# EAGLE design LEDMatrix (EAGLE 6.2)
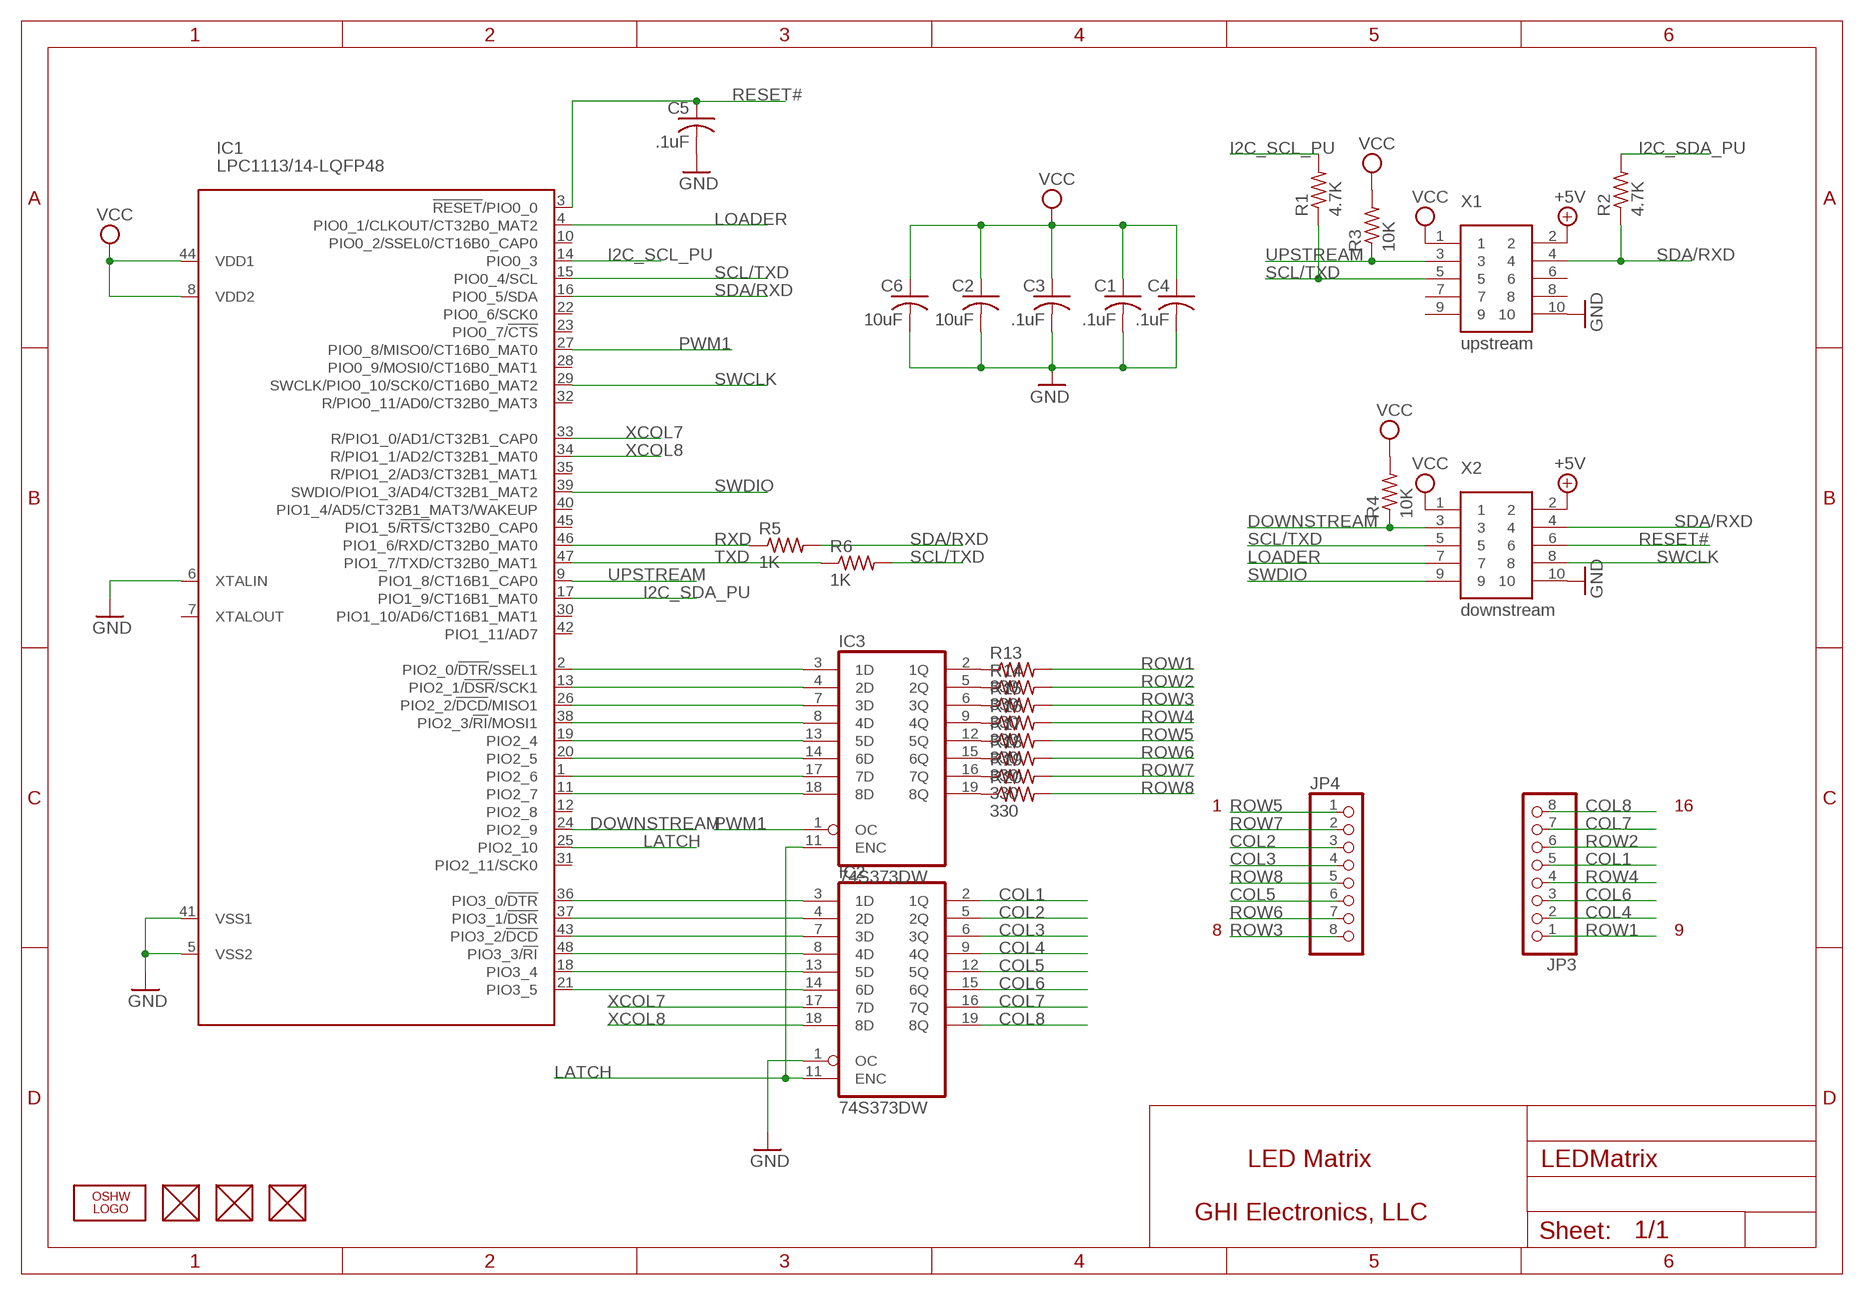
[diagram p0: schematic, sheet 1]

## Parts
C1  .1uF  C-USC0603K  [C0603K]
C2  10uF  C-USC0805K  [C0805K]
C3  .1uF  C-USC0603K  [C0603K]
C4  .1uF  C-USC0603K  [C0603K]
C5  .1uF  C-USC0603K  [C0603K]
C6  10uF  C-USC0805K  [C0805K]
FUD1  FIDUCIAL  [FIDUCIAL_40MIL]
FUD2  FIDUCIAL  [FIDUCIAL_40MIL]
FUD3  FIDUCIAL  [FIDUCIAL_40MIL]
IC1  LPC1113/14-LQFP48  [LQFP48]
IC2  74S373DW  [SO20W]
IC3  74S373DW  [SO20W]
JP3  PINHD-1X8  [1X08]
JP4  PINHD-1X8  [1X08]
LOGO  LOGO-OSHW-FILLX0200-NT  [OSHW_FILLX200_NOTEXT]
R1  4.7K  R-US_R0603  [R0603]
R2  4.7K  R-US_R0603  [R0603]
R3  10K  R-US_R0603  [R0603]
R4  10K  R-US_R0603  [R0603]
R5  1K  R-US_R0603  [R0603]
R6  1K  R-US_R0603  [R0603]
R13  330  R-US_R0603  [R0603]
R14  330  R-US_R0603  [R0603]
R15  330  R-US_R0603  [R0603]
R16  330  R-US_R0603  [R0603]
R17  330  R-US_R0603  [R0603]
R18  330  R-US_R0603  [R0603]
R19  330  R-US_R0603  [R0603]
R20  330  R-US_R0603  [R0603]
X1  upstream  2X5_1.27MM  [2X5_1.27MM]
X2  downstream  2X5_1.27MM  [2X5_1.27MM]

## Nets
+5V [power]: X1.2 X2.2
COL1: IC2.2(1Q) JP3.5
COL2: IC2.5(2Q) JP4.3
COL3: IC2.6(3Q) JP4.4
COL4: IC2.9(4Q) JP3.2
COL5: IC2.12(5Q) JP4.6
COL6: IC2.15(6Q) JP3.3
COL7: IC2.16(7Q) JP3.7
COL8: IC2.19(8Q) JP3.8
DOWNSTREAM: IC1.24(PIO2_9) R4.1 X2.3
GND [power]: C1.2 C2.2 C3.2 C4.2 C5.2 C6.2 IC1.5(VSS2) IC1.6(XTALIN) IC1.41(VSS1) IC2.1(OC) X1.10 X2.10
I2C_SCL_PU: IC1.14(PIO0_3) R1.2
I2C_SDA_PU: IC1.17(PIO1_9/CT16B1_MAT0) R2.2
LATCH: IC1.25(PIO2_10) IC2.11(ENC) IC3.11(ENC)
LOADER: IC1.4(PIO0_1/CLKOUT/CT32B0_MAT2) X2.7
N$11: IC1.36(PIO3_0/!DTR!) IC2.3(1D)
N$12: IC1.37(PIO3_1/!DSR!) IC2.4(2D)
N$13: IC1.43(PIO3_2/!DCD!) IC2.7(3D)
N$14: IC1.48(PIO3_3/!RI!) IC2.8(4D)
N$15: IC1.18(PIO3_4) IC2.13(5D)
N$16: IC1.21(PIO3_5) IC2.14(6D)
N$17: IC3.2(1Q) R13.1
N$18: IC1.2(PIO2_0/!DTR!/SSEL1) IC3.3(1D)
N$19: IC1.13(PIO2_1/!DSR!/SCK1) IC3.4(2D)
N$20: IC1.26(PIO2_2/!DCD!/MISO1) IC3.7(3D)
N$21: IC1.38(PIO2_3/!RI!/MOSI1) IC3.8(4D)
N$22: IC3.5(2Q) R14.1
N$23: IC1.19(PIO2_4) IC3.13(5D)
N$24: IC1.20(PIO2_5) IC3.14(6D)
N$25: IC1.1(PIO2_6) IC3.17(7D)
N$26: IC1.11(PIO2_7) IC3.18(8D)
N$27: IC3.6(3Q) R15.1
N$28: IC3.9(4Q) R16.1
N$29: IC3.12(5Q) R17.1
N$30: IC3.15(6Q) R18.1
N$31: IC3.16(7Q) R19.1
N$32: IC3.19(8Q) R20.1
PWM1: IC1.27(PIO0_8/MISO0/CT16B0_MAT0) IC3.1(OC)
RESET#: C5.1 IC1.3(!RESET!/PIO0_0) X2.6
ROW1: JP3.1 R13.2
ROW2: JP3.6 R14.2
ROW3: JP4.8 R15.2
ROW4: JP3.4 R16.2
ROW5: JP4.1 R17.2
ROW6: JP4.7 R18.2
ROW7: JP4.2 R19.2
ROW8: JP4.5 R20.2
RXD: IC1.46(PIO1_6/RXD/CT32B0_MAT0) R5.1
SCL/TXD: IC1.15(PIO0_4/SCL) R1.1 R6.2 X1.5 X2.5
SDA/RXD: IC1.16(PIO0_5/SDA) R2.1 R5.2 X1.4 X2.4
SWCLK: IC1.29(SWCLK/PIO0_10/SCK0/CT16B0_MAT2) X2.8
SWDIO: IC1.39(SWDIO/PIO1_3/AD4/CT32B1_MAT2) X2.9
TXD: IC1.47(PIO1_7/TXD/CT32B0_MAT1) R6.1
UPSTREAM: IC1.9(PIO1_8/CT16B1_CAP0) R3.1 X1.3
VCC [power]: C1.1 C2.1 C3.1 C4.1 C6.1 IC1.8(VDD2) IC1.44(VDD1) R3.2 R4.2 X1.1 X2.1
XCOL7: IC1.33(R/PIO1_0/AD1/CT32B1_CAP0) IC2.17(7D)
XCOL8: IC1.34(R/PIO1_1/AD2/CT32B1_MAT0) IC2.18(8D)
Unconnected: FUD1.P$1 FUD2.P$1 FUD3.P$1 IC1.7(XTALOUT) IC1.10(PIO0_2/SSEL0/CT16B0_CAP0) IC1.12(PIO2_8) IC1.22(PIO0_6/SCK0) IC1.23(PIO0_7/!CTS!) IC1.28(PIO0_9/MOSI0/CT16B0_MAT1) IC1.30(PIO1_10/AD6/CT16B1_MAT1) IC1.31(PIO2_11/SCK0) IC1.32(R/PIO0_11/AD0/CT32B0_MAT3) IC1.35(R/PIO1_2/AD3/CT32B1_MAT1) IC1.40(PIO1_4/AD5/CT32B1_MAT3/WAKEUP) IC1.42(PIO1_11/AD7) IC1.45(PIO1_5/!RTS!/CT32B0_CAP0) X1.6 X1.7 X1.8 X1.9

## Notes on the sheet
- 1 | 16
- 8 | 9
- LED Matrix
- GHI Electronics, LLC

## Power pins joined to a net without a drawn wire
GND: IC2.10(GND) IC3.10(GND)
VCC: IC2.20(VCC) IC3.20(VCC)

## Library data of the parts
C1-C6 = rcl:C-US: CAPACITOR, American symbol
FUD1-FUD3 = GHI:FIDUCIAL
IC1 = lpc1100v1.1:LPC1113/14-LQFP48: NXP Semiconductors LPC11xx microcontrollers <http://ics.nxp.com/products/lpc1000/lpc11xx/> ARM 32-bit Cortex-M0 Microcontroller with MPU CPU clock up to 50MHz Up to 32KByte on-chip Flash ROM with In-System Programming (ISP) and In-Application Programming (IAP) via On-Chip Bootloader Up to 8KByte SRAM Nested Vectored Interrupt Controller Up to 2 SPI controllers UART with full Modem Interface and RS485 Support Fast Mode I2C-Bus 4 Timers with 4 capture channels and 13 output channels Watchdog (WDT) Sytem tick timer 10-bit ADC with 8 channels Power Management Unit (PMU) Brownout detection 12MHz internal RC oscillator Serial Wire Debug/Trace port
IC2 IC3 = 74xx-us:74*373: Octal D type transparent LATCH, edge triggered
JP3 JP4 = pinhead:PINHD-1X8: PIN HEADER
LOGO = Logo:LOGO-OSHW-FILL
R1-R6 R13-R20 = rcl:R-US_: RESISTOR, American symbol
X1 X2 = GHI:2X5_1.27MM

## Board
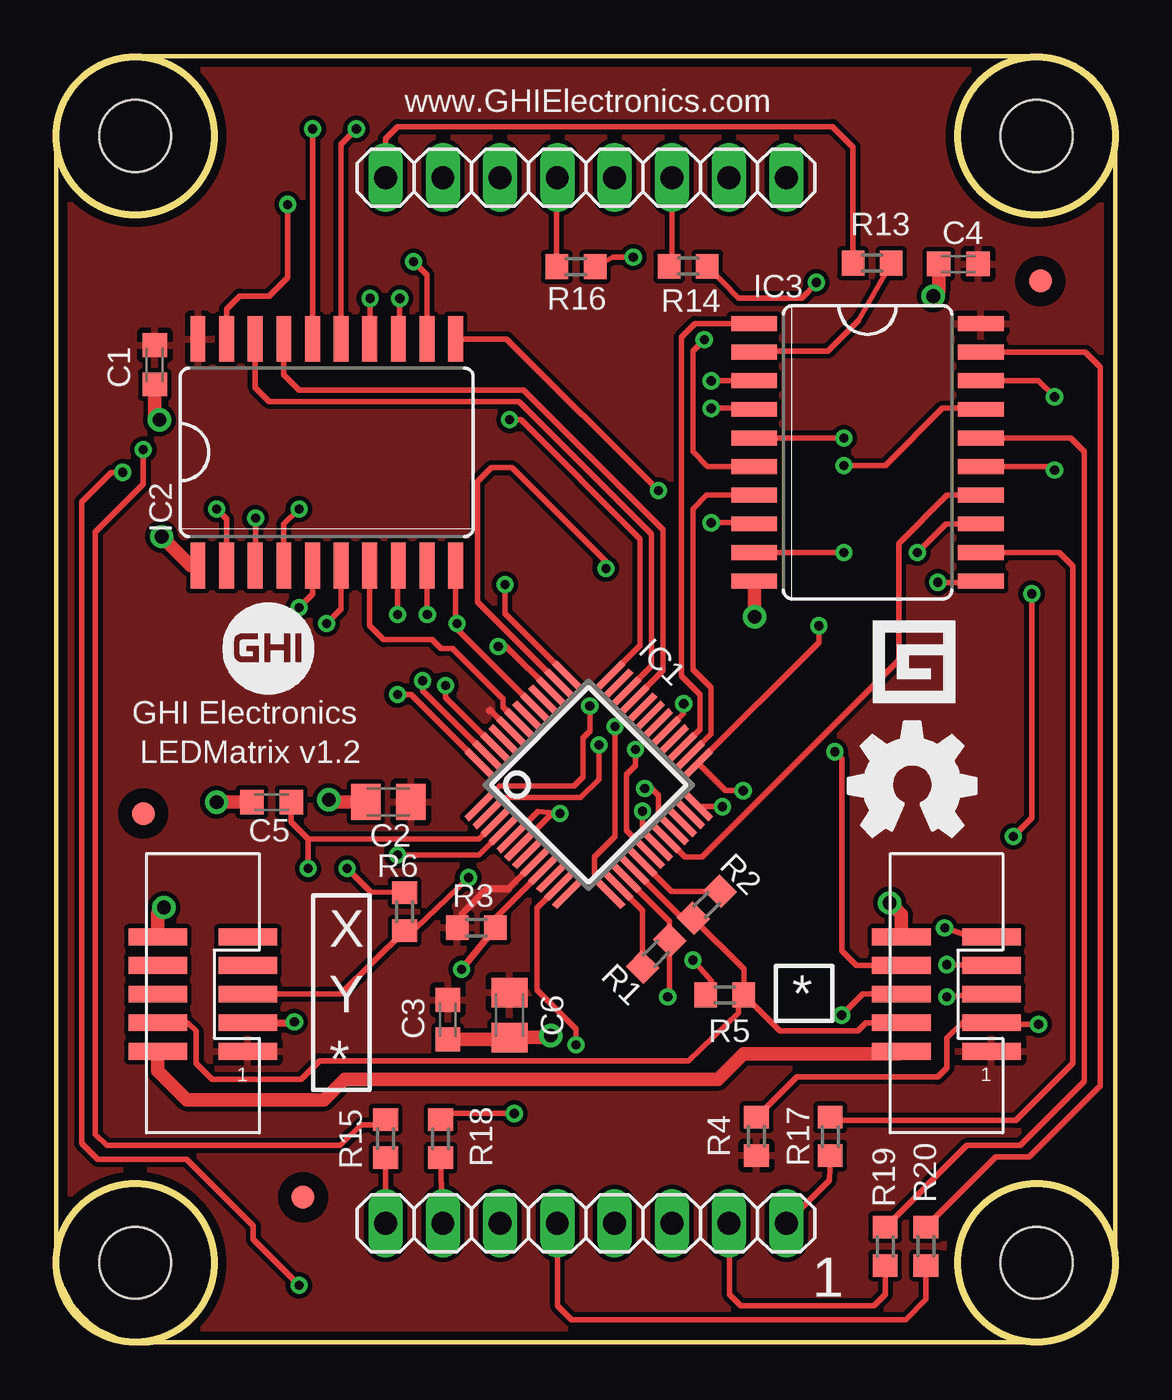
[diagram p1: board, top side]
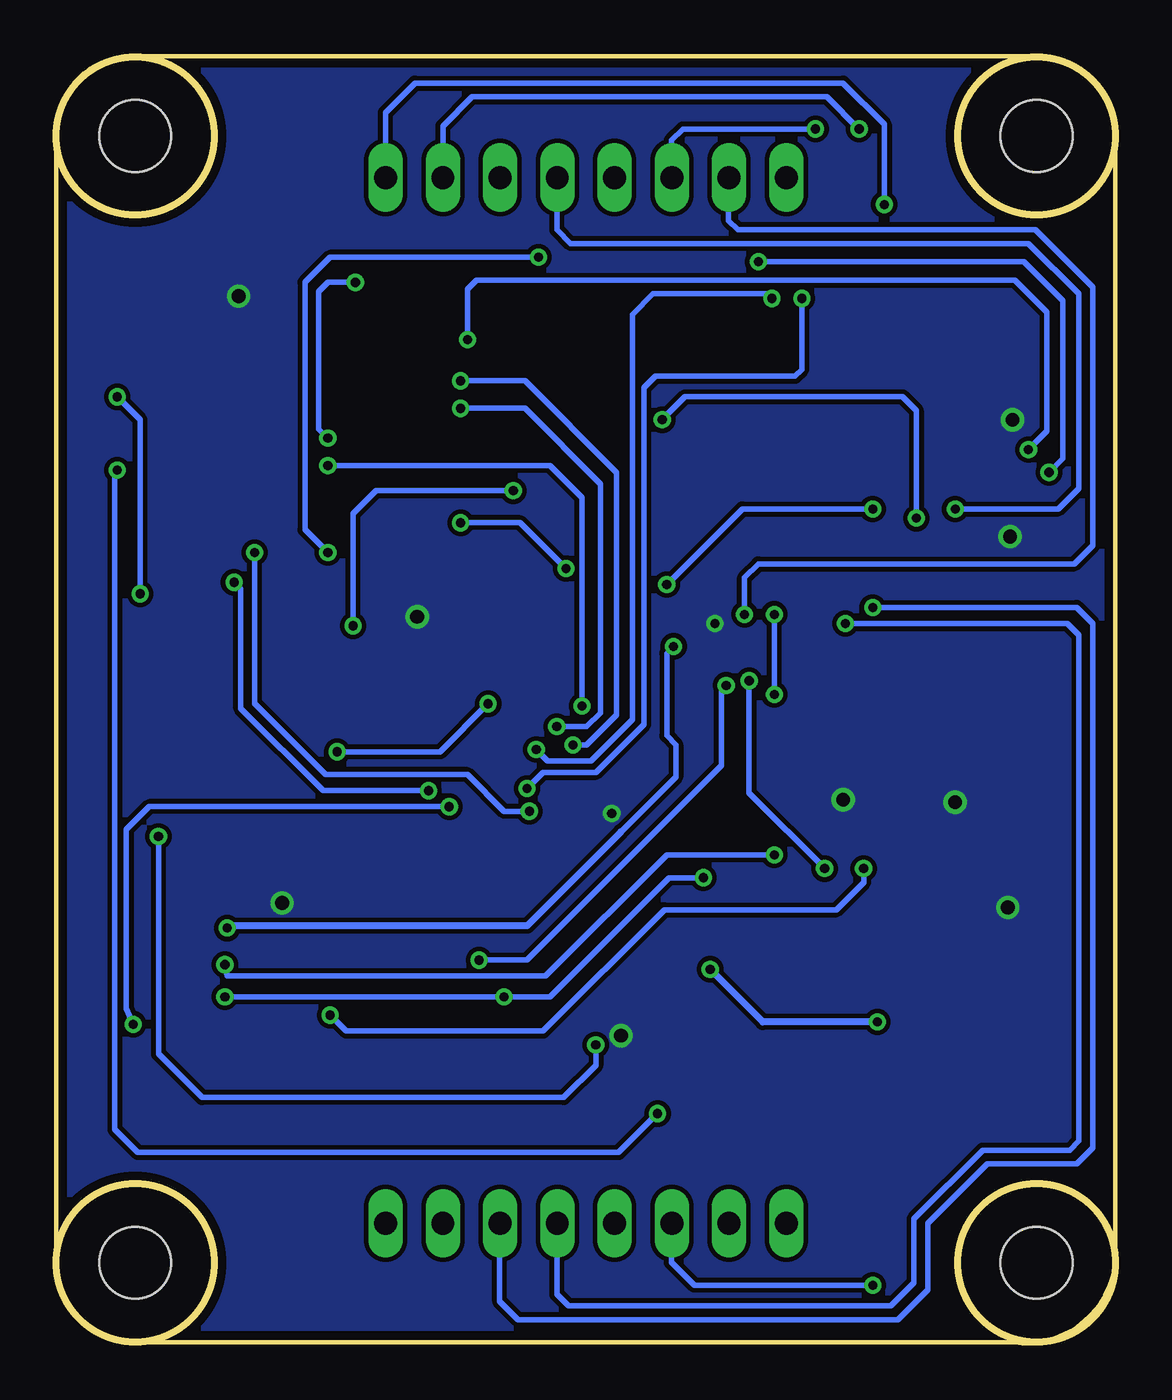
[diagram p2: board, bottom side, seen from below]

Size 47 x 57.1 mm. Coordinates in mm from the lower left corner, seen from the top.
Outline: 0,53.6 0,3.53 arc90 4.5,0.03 43.25,0.03 arc90 47,3.53 47,53.6 arc90 43.75,57.1 3.5,57.1 arc90 0,53.6
Outline: circle at 3.5,3.57 radius 3.5
Outline: circle at 3.5,53.57 radius 3.5
Outline: circle at 43.5,53.57 radius 3.5
Outline: circle at 43.5,3.57 radius 3.5
Copper layers (1+16): Top 0.035mm / dielectric 1.5mm / Bottom 0.035mm
Design rules: minimum track width 8mil, minimum drill 12mil, track to track 8mil, track to pad 8mil, pad to pad 7.5mil, via to via 8mil, smd to smd 7.5mil, copper to edge 15mil, drill to drill 8mil, minimum pad ring 10mil, minimum via ring 7mil, stop-mask expansion 4mil, vias tented up to drill 50mil, thermal gap 10mil
Holes 3.2 mm at 3.5,3.57 3.5,53.57 43.5,53.57 43.5,3.57

### Footprints (pad centres in the part's own frame; a part is rotated, then mirrored left to right if it is on the bottom)
C0603K = smd 1.05 x 1.08: 1 -0.875,0; 2 0.875,0
C0805K = smd 1.3 x 1.6: 1 -1,0; 2 1,0
FIDUCIAL_40MIL = smd 1.016 x 1.016: P$1 0,0
LQFP48 = smd 0.3 x 1.6: 1 -2.75,-4.1; 2 -2.25,-4.1; 3 -1.75,-4.1; 4 -1.25,-4.1; 5 -0.75,-4.1; 6 -0.25,-4.1; 7 0.25,-4.1; 8 0.75,-4.1; 9 1.25,-4.1; 10 1.75,-4.1; 11 2.25,-4.1; 12 2.75,-4.1; 25 2.75,4.1; 26 2.25,4.1; 27 1.75,4.1; 28 1.25,4.1; 29 0.75,4.1; 30 0.25,4.1; 31 -0.25,4.1; 32 -0.75,4.1; 33 -1.25,4.1; 34 -1.75,4.1; 35 -2.25,4.1; 36 -2.75,4.1 | smd 1.6 x 0.3: 13 4.1,-2.75; 14 4.1,-2.25; 15 4.1,-1.75; 16 4.1,-1.25; 17 4.1,-0.75; 18 4.1,-0.25; 19 4.1,0.25; 20 4.1,0.75; 21 4.1,1.25; 22 4.1,1.75; 23 4.1,2.25; 24 4.1,2.75; 37 -4.1,2.75; 38 -4.1,2.25; 39 -4.1,1.75; 40 -4.1,1.25; 41 -4.1,0.75; 42 -4.1,0.25; 43 -4.1,-0.25; 44 -4.1,-0.75; 45 -4.1,-1.25; 46 -4.1,-1.75; 47 -4.1,-2.25; 48 -4.1,-2.75
SO20W = smd 0.66 x 2.032: 1 -5.715,-5.029; 2 -4.445,-5.029; 3 -3.175,-5.029; 4 -1.905,-5.029; 5 -0.635,-5.029; 6 0.635,-5.029; 7 1.905,-5.029; 8 3.175,-5.029; 9 4.445,-5.029; 10 5.715,-5.029; 11 5.715,5.029; 12 4.445,5.029; 13 3.175,5.029; 14 1.905,5.029; 15 0.635,5.029; 16 -0.635,5.029; 17 -1.905,5.029; 18 -3.175,5.029; 19 -4.445,5.029; 20 -5.715,5.029
1X08 = drill 1.016 long: 1 -8.89,0; 2 -6.35,0; 3 -3.81,0; 4 -1.27,0; 5 1.27,0; 6 3.81,0; 7 6.35,0; 8 8.89,0
R0603 = smd 1 x 1.1: 1 -0.85,0; 2 0.85,0
2X5_1.27MM = smd 2.6 x 0.74: 1 -2,2.58; 2 2,2.58; 3 -2,1.31; 4 2,1.31; 5 -2,0.04; 6 2,0.04; 7 -2,-1.23; 8 2,-1.23; 9 -2,-2.5; 10 2,-2.5

### Placement (x,y rotation side)
C1  4.37,43.41 270 top
C2  14.73,24.01 180 top
C3  17.37,14.35 270 top
C4  40.03,47.88 180 top
C5  9.55,24.01 180 top
C6  20.12,14.56 270 top
FUD1  3.86,23.5 0 top
FUD2  43.67,47.13 0 top
FUD3  10.95,6.48 0 top
IC1  23.63,24.78 315 top
IC2  12,39.53 0 top
IC3  36,39.53 270 top
JP3  23.5,51.72 0 top
JP4  23.5,5.32 180 top
LOGO  35.14,22.49 0 top
R1  26.61,17.28 225 top
R2  28.86,19.45 45 top
R3  18.63,18.44 180 top
R4  31.07,9.18 270 top
R5  29.66,15.46 0 top
R6  15.45,19.15 270 top
R13  36.2,47.92 180 top
R14  28.04,47.78 180 top
R15  14.61,9.08 270 top
R16  23.06,47.76 180 top
R17  34.34,9.17 270 top
R18  17.05,9.08 270 top
R19  36.78,4.3 270 top
R20  38.59,4.3 270 top
X1  6.5,15.53 180 top
X2  39.5,15.53 180 top

### Tracks (layer width: path | path; a pad name or v marks a point on that pad's centre or on a via)
+5V
  Top 0.61: X1.2 4.5,12.09 5.79,10.8 11.89,10.8 12.8,11.71 29.36,11.71 30.48,12.83 37.38,12.83 X2.2
COL1  (via drill 0.41)
  Top 0.254: IC2.2 7.56,36.57 v7.11,37.01
  Bottom 0.254: v7.11,37.01 2.54,37.01 1.63,37.93 1.63,46.56 3.86,48.8 24.18,48.8 24.79,49.41 24.79,51.7 JP3.5
COL2  (via drill 0.41)
  Top 0.254: IC2.5 11.37,33.24 v10.77,32.64
  Bottom 0.254: v10.77,32.64 1.73,32.64 1.02,31.93 1.02,8.67 1.73,7.95 5.69,7.95 8.33,5.31 8.33,2.37 9.65,1.05 26.52,1.05 27.33,1.86 27.33,5.3 JP4.3
COL3  (via drill 0.41)
  Top 0.254: IC2.6 12.64,32.58 v11.99,31.93
  Bottom 0.254: v11.99,31.93 2.13,31.93 1.63,31.42 1.63,8.97 2.03,8.56 5.89,8.56 8.94,5.52 8.94,2.67 9.96,1.66 24.28,1.66 24.79,2.16 24.79,5.3 JP4.4
COL4  (via drill 0.41)
  Top 0.254: IC2.9 16.45,32.35 v16.46,32.34
  Bottom 0.254: v16.46,32.34 16.46,33.96 15.85,34.57 1.83,34.57 1.02,35.39 1.02,46.87 3.56,49.41 16.76,49.41 17.17,49.81 17.17,51.7 JP3.2
COL5  (via drill 0.41)
  Top 0.254: IC2.12 16.45,47.39 v15.85,47.98 | v2.95,38.64 2.44,38.64 1.12,37.32 1.12,8.87 1.83,8.16 5.79,8.16 8.74,5.21 8.74,4.6 v10.77,2.57
  Bottom 0.254: v15.85,47.98 4.06,47.98 2.34,46.26 2.34,39.25 v2.95,38.64 | v10.77,2.57 18.69,2.57 19.71,3.59 19.71,5.3 JP4.6
COL6  (via drill 0.41)
  Top 0.254: IC2.15 12.64,53.2 v13.31,53.88
  Bottom 0.254: v13.31,53.88 19.2,53.88 19.71,53.37 19.71,51.74 JP3.3
COL7  (via drill 0.41)
  Top 0.254: v11.38,53.88 11.38,44.57 IC2.16
  Bottom 0.254: JP3.7 29.85,54 28.55,55.3 12.8,55.3 v11.38,53.88
COL8  (via drill 0.41)
  Top 0.254: v10.26,50.52 10.26,47.27 9.45,46.46 8.13,46.46 7.56,45.89 IC2.19
  Bottom 0.254: JP3.8 32.39,54.61 31.09,55.91 12.09,55.91 10.26,54.08 v10.26,50.52
DOWNSTREAM  (via drill 0.41)
  Top 0.254: IC1.24 28.49,23.8 v29.57,23.8 | v43.59,14.15 41.57,14.15 X2.3 40.2,14.22 39.52,13.54 39.52,12.22 39.12,11.82 32.86,11.82 R4.1
  Bottom 0.254: v29.57,23.8 42.88,23.8 43.89,22.79 43.89,14.86 v43.59,14.15
GND  (via drill 0.41, 0.61)
  Top 0.254: IC1.5 21.39,23.6 v22.35,23.5 21.95,23.45 IC1.6 | IC1.41 17.78,31.69 v17.78,31.93 17.72,32 IC2.10
  Top 0.61: X1.10 4.5,19.06 v4.78,19.33 | X2.10 37.5,19.02 v36.98,19.54 | IC3.10 30.97,32.25 v30.99,32.24 | IC2.1 5.97,34.5 v4.67,35.79 | C5.2 v7.11,24.01 | C1.2 4.37,41.18 v4.57,40.97 | C4.2 39.16,46.7 v38.91,46.46 | C2.2 12.19,24.01 v12.09,24.11 | C3.2 20.04,13.48 C6.2 21.86,13.56 v21.95,13.64
  pour Bottom: 0.1,57.13 0.1,0.13 47.04,0.13 47.04,57.13
I2C_SCL_PU
  Top 0.254: IC1.14 26.01,19.21 R1.2
I2C_SDA_PU
  Top 0.254: IC1.17 27.29,20.05 R2.2
LATCH  (via drill 0.41)
  Top 0.254: v30.48,24.52 29.69,24.52 IC1.25 33.83,31.1 v33.83,31.83 | v39.12,33.76 40.98,33.76 IC3.11 | v26.72,37.82 19.99,44.56 IC2.11
  Bottom 0.254: v30.48,24.52 35.15,24.52 38.81,28.17 38.81,33.46 v39.12,33.76 | v33.83,31.83 33.83,36.81 32.82,37.82 v26.72,37.82
LOADER  (via drill 0.41)
  Top 0.254: IC1.4 18.75,21.67 v15.14,21.67 | v39.52,16.79 41.47,16.79 X2.7
  Bottom 0.254: v15.14,21.67 19.91,21.67 25.3,16.29 39.42,16.29 v39.52,16.79
N$11  (via drill 0.41)
  Top 0.254: IC1.36 25.91,30.95 25.91,35.69 20.63,40.97 v20.12,40.97 | v8.84,36.61 8.84,34.51 IC2.3
  Bottom 0.254: v20.12,40.97 19.1,41.99 9.45,41.99 8.84,41.38 v8.84,36.61
N$12  (via drill 0.41)
  Top 0.254: IC1.37 19.91,32.38 v19.91,33.66 | v10.77,37.01 10.1,36.34 IC2.4
  Bottom 0.254: v19.91,33.66 16.56,37.01 v10.77,37.01
N$13
  Top 0.254: IC2.7 13.91,31.84 14.53,31.22 16.66,31.22 17.07,30.81 17.58,30.81 19.81,28.58 19.81,28.24 IC1.43
N$14  (via drill 0.41)
  Top 0.254: IC1.48 15.73,28.78 v15.14,28.78 | v15.14,32.34 15.14,34.46 IC2.8
  Bottom 0.254: v15.14,28.78 v15.14,32.34
N$15  (via drill 0.41)
  Top 0.254: IC1.18 25.3,22.75 25.3,25.23 25.71,25.63 v25.71,26.34 | v15.24,46.36 15.24,44.62 IC2.13
  Bottom 0.254: v25.71,26.34 25.2,25.84 23.27,25.84 21.44,27.66 21.44,45.65 20.52,46.56 15.44,46.56 v15.24,46.36
N$16  (via drill 0.41)
  Top 0.254: IC1.21 26.72,23.45 26.72,24.31 26.42,24.62 v26.11,24.62 | v13.92,46.36 13.92,44.57 IC2.14
  Bottom 0.254: v26.11,24.62 25.4,25.33 23.06,25.33 20.93,27.46 20.93,42.4 20.42,42.9 14.22,42.9 13.92,43.21 v13.92,46.36
N$17
  Top 0.254: R13.1 35.6,45.38 34.24,44.02 31.02,44.02 IC3.2
N$18  (via drill 0.41)
  Top 0.254: IC1.2 19.87,24.21 23.27,24.21 24.08,25.02 v24.08,26.55 | v29.06,42.7 IC3.3
  Bottom 0.254: v24.08,26.55 23.47,26.55 22.15,27.87 22.15,38.64 26.21,42.7 v29.06,42.7
N$19  (via drill 0.41)
  Top 0.254: v29.06,41.48 30.92,41.48 IC3.4 | IC1.13 23.88,20.64 23.88,21.57 24.79,22.48 v24.79,27.36
  Bottom 0.254: v29.06,41.48 26.21,41.48 22.86,38.13 22.86,27.97 23.47,27.36 v24.79,27.36
N$20
  Top 0.254: IC1.26 29.06,27.03 29.06,29.09 28.25,29.9 28.25,37.01 28.86,37.62 IC3.7
N$21  (via drill 0.41)
  Top 0.254: IC1.38 18.69,32.89 18.69,38.23 19.3,38.84 20.22,38.84 24.38,34.68 v24.38,34.37 | v29.06,36.4 30.92,36.4 IC3.8
  Bottom 0.254: v24.38,34.37 26.42,36.4 v29.06,36.4
N$22  (via drill 0.41)
  Top 0.254: R14.1 30.28,46.36 33.09,46.36 33.36,46.63 v33.73,47.07 | v34.95,40.16 IC3.5
  Bottom 0.254: v33.73,47.07 34.95,47.07 35.36,46.66 35.36,40.57 v34.95,40.16
N$23  (via drill 0.41)
  Top 0.254: IC1.19 26.01,22.75 v26.01,23.6 | v38.2,35.08 39.48,36.35 IC3.13
  Bottom 0.254: v38.2,35.08 38.2,28.38 35.05,25.23 28.75,25.23 27.13,23.6 v26.01,23.6
N$24
  Top 0.254: IC1.20 27.9,21.57 28.65,21.57 37.39,30.31 37.39,35.49 39.53,37.62 IC3.14
N$25  (via drill 0.41)
  Top 0.254: v34.95,38.94 36.78,38.94 39.32,41.48 40.98,41.48 IC3.17 | IC1.1 19.68,24.72 22.96,24.72 23.37,25.12 23.37,26.85 23.67,27.16 v23.67,28.27
  Bottom 0.254: v23.67,28.27 23.67,37.52 25.1,38.94 v34.95,38.94
N$26  (via drill 0.41)
  Top 0.254: IC1.11 21.34,19.31 21.34,15.68 23.06,13.95 v23.06,13.24 | v42.47,22.48 43.28,23.3 v43.28,33.25 | v44.3,41.99 43.58,42.7 IC3.18
  Bottom 0.254: v42.47,22.48 42.47,12.83 40.54,10.9 24.49,10.9 23.06,12.32 v23.06,13.24 | v43.28,33.25 43.28,40.97 v44.3,41.99
N$27  (via drill 0.41)
  Top 0.254: IC3.6 28.9,38.89 28.25,39.55 28.25,44.02 v28.75,44.53 | v3.86,39.65 3.86,38.13 1.73,36 1.73,9.28 2.24,8.77 12.6,8.77 13.51,9.68 14.57,9.68 R15.1
  Bottom 0.254: v28.75,44.53 28.75,46.77 28.35,47.17 4.47,47.17 3.05,45.75 3.05,40.47 v3.86,39.65
N$28  (via drill 0.41)
  Top 0.254: R16.1 24.7,48.19 v25.6,48.19 | v34.95,35.08 IC3.9
  Bottom 0.254: v25.6,48.19 34.85,48.19 35.97,47.07 35.97,36.1 v34.95,35.08
N$29
  Top 0.254: IC3.12 44.5,35.08 45.11,34.47 45.11,12.42 42.57,9.88 34.68,9.88 R17.1
N$30  (via drill 0.41)
  Top 0.254: IC3.15 44.14,38.89 v44.3,38.74 | v20.32,10.19 17.31,10.19 R18.1
  Bottom 0.254: v44.3,38.74 44.09,38.74 44.4,38.43 44.4,9.48 43.38,8.46 22.05,8.46 v20.32,10.19
N$31
  Top 0.254: IC3.16 45.01,40.16 45.62,39.55 45.62,11.61 42.77,8.77 40.4,8.77 R19.1
N$32
  Top 0.254: IC3.19 45.67,43.97 46.33,43.31 46.33,11.41 43.18,8.26 41.7,8.26 R20.1
PWM1
  Top 0.254: IC1.27 28.55,27.23 28.55,28.78 27.74,29.6 27.74,44.63 28.35,45.24 IC3.1
RESET#  (via drill 0.41)
  Top 0.254: IC1.3 18.75,22.38 11.18,22.38 | 11.18,22.38 10.43,23.13 C5.1 | X2.6 35.78,15.49 v34.85,14.56 | v11.18,21.06 11.18,22.38
  Bottom 0.254: v34.85,14.56 34.14,13.85 25.4,13.85 20.02,19.23 12.4,19.23 11.18,20.45 v11.18,21.06
ROW1
  Top 0.254: JP3.1 14.61,53.45 15.14,53.98 34.44,53.98 35.36,53.06 35.36,51.69 R13.2
ROW2
  Top 0.254: JP3.6 27.31,48.14 R14.2
ROW3
  Top 0.254: R15.2 JP4.8
ROW4
  Top 0.254: R16.2 22.21,51.7 JP3.4
ROW5
  Top 0.254: R17.2 34.3,7.23 JP4.1
ROW6
  Top 0.254: R18.2 JP4.7
ROW7
  Top 0.254: R19.2 36.78,2.16 36.27,1.66 30.38,1.66 29.87,2.16 29.87,5.3 JP4.2
ROW8
  Top 0.254: R20.2 38.59,1.94 37.69,1.05 22.86,1.05 22.25,1.66 22.25,5.3 JP4.5
RXD  (via drill 0.41)
  Top 0.254: R5.1 29.07,16.07 v28.25,17 | v17.27,29.19 17.27,28.66 IC1.46
  Bottom 0.254: v28.25,17 26.11,17 17.48,25.63 17.48,28.99 v17.27,29.19
SCL/TXD  (via drill 0.41)
  Top 0.254: IC1.15 27.21,18.72 R1.1 27.21,15.59 v27.13,15.37 | v39.52,15.37 41.42,15.57 X2.5 | v18.29,20.65 15.94,18.41 R6.2 12.63,15.49 X1.5
  Bottom 0.254: v39.52,15.37 v27.13,15.37 25.1,15.37 19.81,20.65 v18.29,20.65
SDA/RXD
  Top 0.254: IC1.16 27.79,18.85 R2.1 30.51,16.6 R5.2 | X1.4 5.83,14.22 6.2,13.85 6.2,12.42 6.91,11.71 10.87,11.71 11.68,12.53 28.04,12.53 30.28,14.66 30.28,15.38 R5.2 | X2.4 35.93,14.22 35.56,13.85 32.11,13.85 R5.2
SWCLK  (via drill 0.41)
  Top 0.254: IC1.29 27.84,27.93 v27.84,28.38 | v34.54,26.24 34.85,25.94 34.85,17.4 35.49,16.76 X2.8
  Bottom 0.254: v27.84,28.38 29.97,26.24 v34.54,26.24
SWDIO  (via drill 0.41)
  Top 0.254: v39.42,18.42 40.62,18.03 X2.9 | IC1.39 19.96,30.92 v19.61,30.92
  Bottom 0.254: v19.61,30.92 19.91,30.61 19.91,26.95 19.51,26.55 19.51,25.12 21.95,22.69
  Bottom 0.305: 21.95,22.69 26.11,18.52 39.22,18.52 39.37,18.37 39.47,18.37 v39.42,18.42
TXD  (via drill 0.41)
  Top 0.254: IC1.47 16.26,28.97 v16.26,29.39 | v12.9,21.06 13.94,20.02 R6.1
  Bottom 0.254: v16.26,29.39 16.26,24.41 v12.9,21.06
UPSTREAM  (via drill 0.41)
  Top 0.254: IC1.9 19.24,18.62 R3.1
  Top 0.305: X1.3 10.53,14.22 v10.57,14.25 | v17.98,16.59 v17.99,16.59 R3.1
  Bottom 0.305: v10.57,14.25 15.65,14.25 v17.98,16.59
VCC
  Top 0.254: IC1.8 20.05,20.15 | IC1.44 19.27,28.07
  Top 0.305: 20.05,20.15 19.1,20.15 18.03,19.08 R3.2 | 19.27,28.07 19.2,28.07
  pour Top: 0,57.53 0,-0.48 47.24,-0.48 47.24,57.53
XCOL7
  Top 0.254: IC1.33 26.92,29.85 26.92,36.1 20.73,42.3 10.77,42.3 10.1,42.97 IC2.17
XCOL8
  Top 0.254: IC1.34 26.42,30.05 26.42,35.89 20.52,41.79 9.45,41.79 8.83,42.41 IC2.18

### Text on the board
tPlace: www.GHIElectronics.com | GHI Electronics | LEDMatrix v1.2 | X | Y | * | * | 1